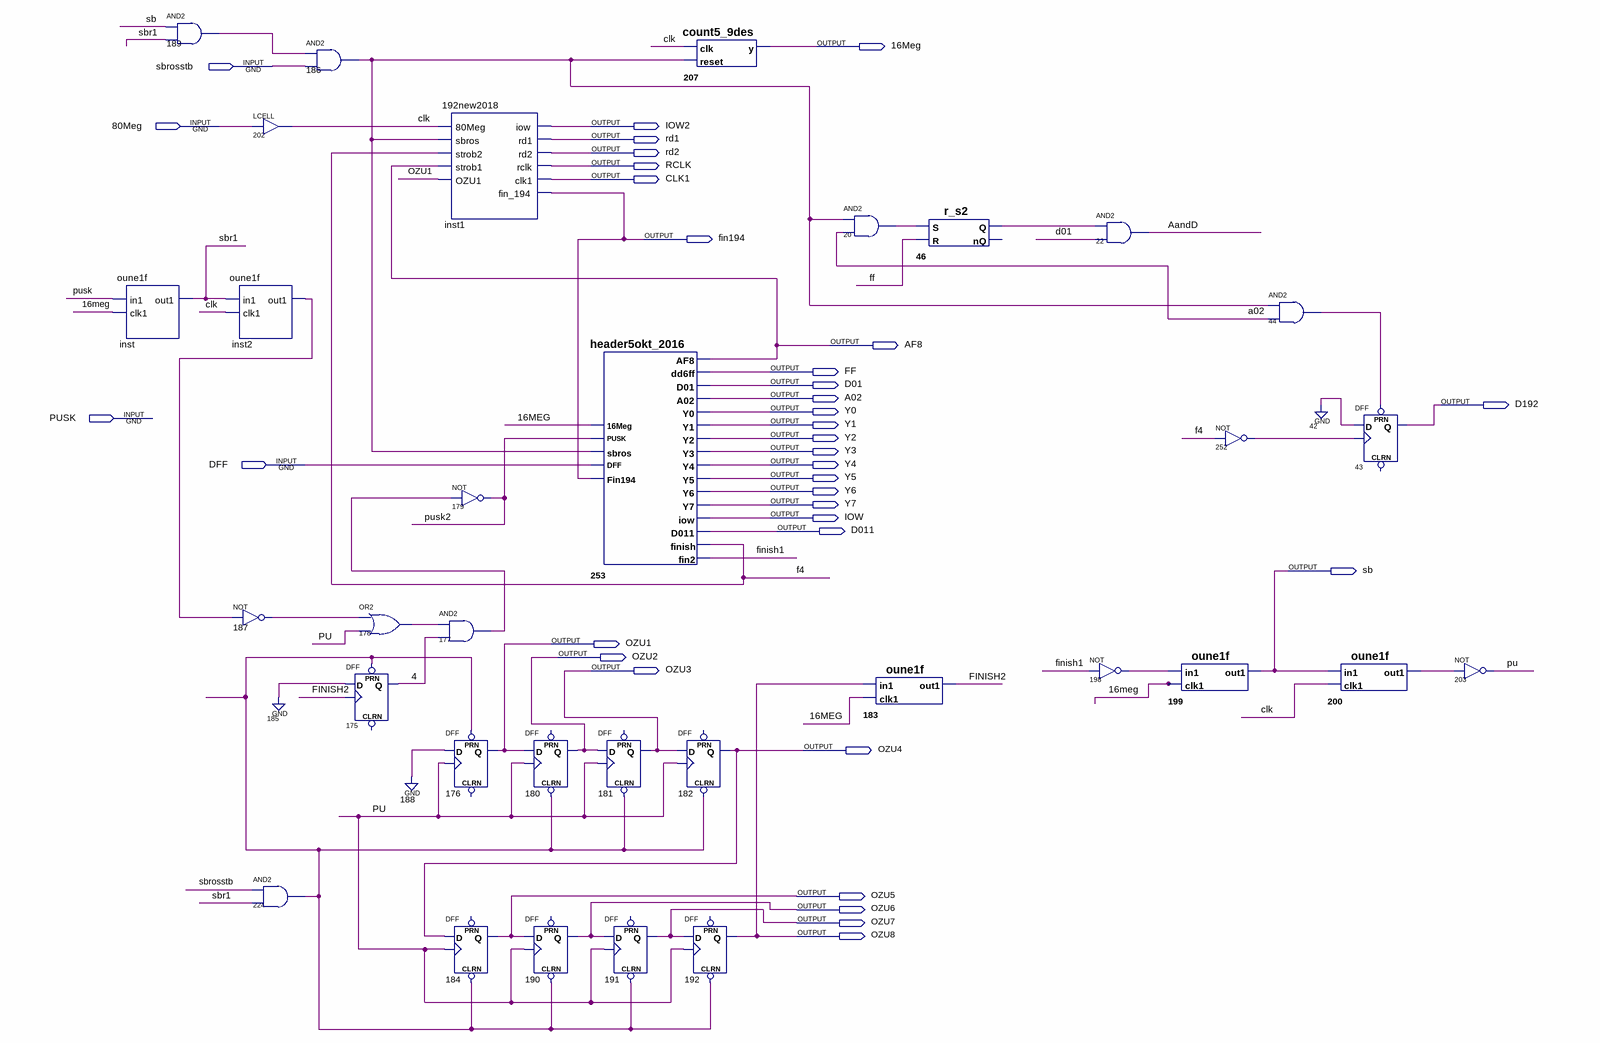
[diagram p0: schematic sheet]
// Quartus schematic vdether10novugolev.bdf as structural Verilog: 33 symbols, 35 pins
module vdether10novugolev (
  input  sbrosstb,
  input  \80Meg ,
  input  PUSK,
  input  DFF,
  output \16Meg ,
  output IOW2,
  output rd1,
  output rd2,
  output RCLK,
  output CLK1,
  output fin194,
  output AF8,
  output FF,
  output D01,
  output A02,
  output D192,
  output Y0,
  output Y1,
  output Y2,
  output Y3,
  output Y4,
  output Y5,
  output Y6,
  output Y7,
  output IOW,
  output D011,
  output sb,
  output OZU1,
  output OZU2,
  output OZU3,
  output OZU4,
  output OZU5,
  output OZU6,
  output OZU7,
  output OZU8
);

  wire \4 , AandD, clk, f4, finish1, FINISH2, inst2_out1, n20_out, n44_out, n46_q, n177_out, n178_out,
       n186_out, n187_out, n189_out, n198_out, n200_out1, n224_out, n252_out, PU, pusk2, sbr1;

  oune1f inst (.in1(PUSK), .clk1(\16Meg ), .out1(sbr1));
  and u_189 (n189_out, sb, sbr1);
  LCELL u_202 (.IN(\80Meg ), .OUT(clk));
  oune1f inst2 (.in1(sbr1), .clk1(clk), .out1(inst2_out1));
  not u_187 (n187_out, inst2_out1);
  and u_224 (n224_out, sbrosstb, sbr1);
  and u_186 (n186_out, n189_out, sbrosstb);
  or u_178 (n178_out, n187_out, PU);
  DFF u_175 (.CLK(FINISH2), .D(1'b0), .PRN(n224_out), .Q(\4 ));  // open: CLRN
  \192new2018  inst1 (
    .\80Meg (clk), .sbros(n186_out), .strob2(f4), .strob1(AF8), .OZU1(OZU1), .iow(IOW2), .rd1(rd1),
    .rd2(rd2), .rclk(RCLK), .clk1(CLK1), .fin_194(fin194));
  not u_179 (pusk2, n177_out);
  and u_177 (n177_out, n178_out, \4 );
  DFF u_176 (.CLK(PU), .D(1'b0), .PRN(n224_out), .Q(OZU1));  // open: CLRN
  DFF u_184 (.CLRN(n224_out), .CLK(PU), .D(OZU4), .Q(OZU5));  // open: PRN
  DFF u_180 (.CLRN(n224_out), .CLK(PU), .D(OZU1), .Q(OZU2));  // open: PRN
  DFF u_190 (.CLRN(n224_out), .CLK(PU), .D(OZU5), .Q(OZU6));  // open: PRN
  header5okt_2016 u_253 (
    .\16Meg (\16Meg ), .PUSK(pusk2), .sbros(n186_out), .DFF(DFF), .Fin194(fin194), .AF8(AF8), .dd6ff(FF),
    .D01(D01), .A02(A02), .Y0(Y0), .Y1(Y1), .Y2(Y2), .Y3(Y3), .Y4(Y4), .Y5(Y5), .Y6(Y6), .Y7(Y7), .iow(IOW),
    .D011(D011), .finish(f4), .fin2(finish1));
  DFF u_181 (.CLRN(n224_out), .CLK(PU), .D(OZU2), .Q(OZU3));  // open: PRN
  DFF u_191 (.CLRN(n224_out), .CLK(PU), .D(OZU6), .Q(OZU7));  // open: PRN
  count5_9des u_207 (.clk(clk), .reset(n186_out), .y(\16Meg ));
  DFF u_182 (.CLRN(n224_out), .CLK(PU), .D(OZU3), .Q(OZU4));  // open: PRN
  DFF u_192 (.CLRN(n224_out), .CLK(PU), .D(OZU7), .Q(OZU8));  // open: PRN
  and u_20 (n20_out, n186_out, A02);
  oune1f u_183 (.in1(OZU8), .clk1(\16Meg ), .out1(FINISH2));
  r_s2 u_46 (.S(n20_out), .R(FF), .Q(n46_q));  // open: nQ
  and u_22 (AandD, n46_q, D01);
  not u_198 (n198_out, finish1);
  oune1f u_199 (.in1(n198_out), .clk1(\16Meg ), .out1(sb));
  not u_252 (n252_out, f4);
  and u_44 (n44_out, n186_out, A02);
  oune1f u_200 (.in1(sb), .clk1(clk), .out1(n200_out1));
  DFF u_43 (.CLK(n252_out), .D(1'b0), .PRN(n44_out), .Q(D192));  // open: CLRN
  not u_203 (PU, n200_out1);
endmodule
